# Altium schematic sheet ProtectionLED.SchDoc: ProtectionLED
size Letter; DocumentNumber: 2; SheetNumber: 2; SheetTotal: 4; Conceptor: Philippe T. Simon B. Léonard G. Alexia B-L.; Version: Gamma 1.0
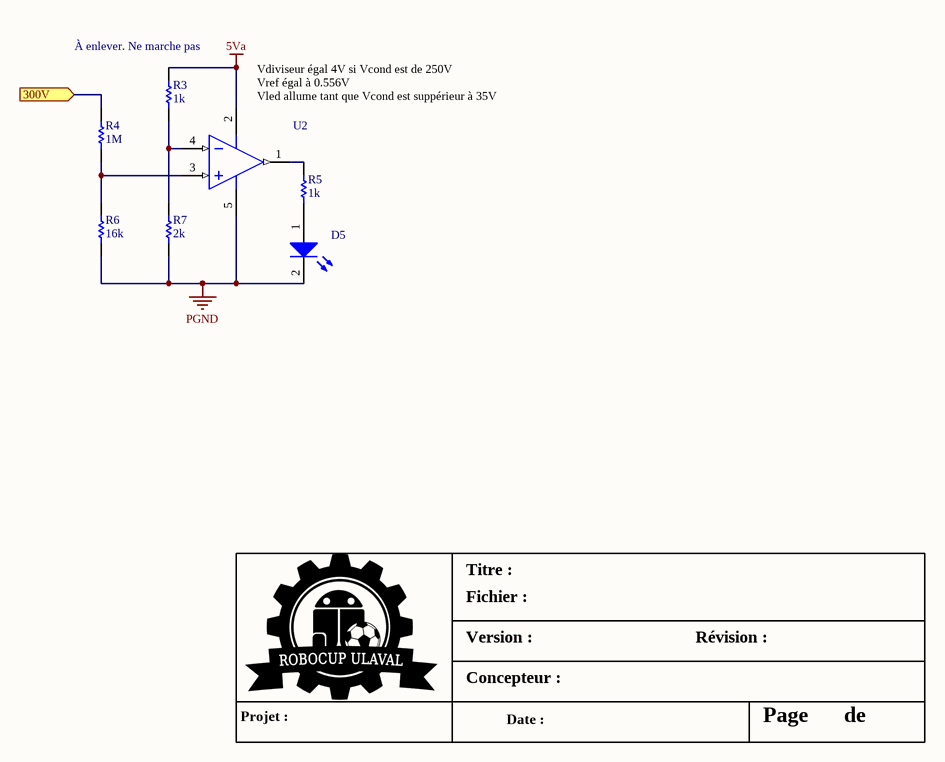
[diagram p0: ProtectionLED.SchDoc]

## Parts
D5  APT3216SRCPRV  [1206]  (value not drawn)
R3  Resistance (Ohms): 1k  [0603]  (hidden comment: RC0603JR-071KL)
R4  Resistance (Ohms): 1M  [0603]  (hidden comment: RC0603FR-071ML)
R5  Resistance (Ohms): 1k  [0603]  (hidden comment: RC0603JR-071KL)
R6  Resistance (Ohms): 16k  [1206]  (hidden comment: ERJ-8GEYJ163V)
R7  Resistance (Ohms): 2k  [0603]  (hidden comment: ESR03EZPJ202)
U2  opamp - MCP6L71RT-E/OTCT-ND  [SOT-23-5]  (value not drawn)

## Ports
300V (in)

## Nets
5Va: R3.2 U2.2(V+)
PGND: D5.2(K) R6.2 R7.1 U2.5(V-)
300V: R4.2 ; port 300V
NetD5_1: D5.1(A) R5.1
NetR3_1: R3.1 R7.2 U2.4(IN-)
NetR4_1: R4.1 R6.1 U2.3(IN+)
NetR5_2: R5.2 U2.1(OUT)

## Notes on the sheet
- (near R3) À enlever. Ne marche pas
- (near U2) Vdiviseur égal 4V si Vcond est de 250V
  Vref égal à 0.556V
  Vled allume tant que Vcond est suppérieur à 35V
- Titre :
- Version :
- Fichier :
- Révision :
- Projet :
- Concepteur :
- Date :
- Page
- de

## Library data of the parts
D5 = APT3216SRCPRV: LED RED CLEAR 1206 SMD; Manufacturer: Kingbright; Lens Color: Colorless; Millicandela Rating: 30mcd; Lens Style/Size: Rectangle with Flat Top, 2.00mm x 1.60mm; Voltage - Forward (Vf) (Typ): 1.85V; Current - Test: 20mA; Viewing Angle: 120°; Wavelength - Dominant: 640nm; Wavelength - Peak: 655nm; Supplier 1: Digi-Key; Manufacturer Part Number: APT3216SRCPRV; RoHS: RoHS Compliant; Category: Optoelectronics; Stock 1: 56279; Pricing 1: 1=0.64, 10=0.462, 25=0.3536, 100=0.2308, 250=0.1692, 500=0.14356, 1000=0.11793 (CAD); Packaging: Cut Tape (CT); Part Status: Active; Color: Red; Lens Transparency: Clear; Mounting Type: Surface Mount; Features: -; Package / Case: 1206 (3216 Metric); Supplier Device Package: Chip LED; Size / Dimension: 3.20mm L x 1.60mm W; Height (Max): 0.75mm; ComponentLink1URL: http://www.kingbrightusa.com/images/catalog/SPEC/APT3216SRCPRV.pdf; ComponentLink1Description: http://www.kingbrightusa.com/images/catalog/SPEC/APT3216SRCPRV.pdf; Supplier Part Number 1: 754-1142-1-ND
R3 R5 = RC0603JR-071KL: RES SMD 1K OHM 5% 1/10W 0603; Manufacturer: Yageo; Power (Watts): 0.1W, 1/10W; Temperature Coefficient: ±100ppm/°C; Supplier 1: Digi-Key; Manufacturer Part Number: RC0603JR-071KL; RoHS: RoHS Compliant; Category: Resistors; Stock 1: 1078221; Pricing 1: 1=0.15, 10=0.017, 25=0.012, 100=0.0067, 250=0.00508, 500=0.00408, 1000=0.003, 2500=0.0026 (CAD); Packaging: Cut Tape (CT); Tolerance: ±5%; Composition: Thick Film; Features: Moisture Resistant; Operating Temperature: -55°C ~ 155°C; Package / Case: 0603 (1608 Metric); Supplier Device Package: 0603; Size / Dimension: 0.063" L x 0.031" W (1.60mm x 0.80mm); Height: 0.022" (0.55mm); Number of Terminations: 2; ComponentLink1URL: http://www.yageo.com/documents/recent/PYu-RC_Group_51_RoHS_L_04.pdf; ComponentLink1Description: http://www.yageo.com/documents/recent/PYu-RC_Group_51_RoHS_L_04.pdf; Supplier Part Number 1: 311-1.0KGRCT-ND
R4 = RC0603FR-071ML: RES SMD 1M OHM 1% 1/10W 0603; Manufacturer: Yageo; Power (Watts): 0.1W, 1/10W; Temperature Coefficient: ±100ppm/°C; Supplier 1: Digi-Key; Manufacturer Part Number: RC0603FR-071ML; RoHS: RoHS Compliant; Category: Resistors; Stock 1: 1571699; Pricing 1: 1=0.15, 10=0.021, 25=0.0152, 100=0.0086, 250=0.0066, 500=0.00526, 1000=0.00389, 2500=0.00337 (CAD); Packaging: Cut Tape (CT); Tolerance: ±1%; Composition: Thick Film; Features: Moisture Resistant; Operating Temperature: -55°C ~ 155°C; Package / Case: 0603 (1608 Metric); Supplier Device Package: 0603; Size / Dimension: 0.063" L x 0.031" W (1.60mm x 0.80mm); Height: 0.022" (0.55mm); Number of Terminations: 2; ComponentLink1URL: http://www.yageo.com/documents/recent/PYu-RC_Group_51_RoHS_L_04.pdf; ComponentLink1Description: http://www.yageo.com/documents/recent/PYu-RC_Group_51_RoHS_L_04.pdf; Supplier Part Number 1: 311-1.00MHRCT-ND
R6 = ERJ-8GEYJ163V: RES SMD 16K OHM 5% 1/4W 1206; Manufacturer: Panasonic Electronic Components; Power (Watts): 0.25W, 1/4W; Temperature Coefficient: ±200ppm/°C; Supplier 1: Digi-Key; Manufacturer Part Number: ERJ-8GEYJ163V; RoHS: RoHS Compliant; Category: Resistors; Stock 1: 39630; Pricing 1: 1=0.15, 50=0.0318, 100=0.0235, 250=0.01788, 500=0.01428, 1000=0.01053 (CAD); Packaging: Cut Tape (CT); Part Status: Active; Tolerance: ±5%; Composition: Thick Film; Features: Automotive AEC-Q200; Operating Temperature: -55°C ~ 155°C; Package / Case: 1206 (3216 Metric); Supplier Device Package: 1206; Size / Dimension: 0.126" L x 0.063" W (3.20mm x 1.60mm); Height - Seated (Max): 0.028" (0.70mm); Number of Terminations: 2; Failure Rate: -; ComponentLink1URL: http://industrial.panasonic.com/www-cgi/jvcr13pz.cgi?E+PZ+3+AOA0001+ERJ8GEYJ163V+7+WW; ComponentLink1Description: http://industrial.panasonic.com/www-cgi/jvcr13pz.cgi?E+PZ+3+AOA0001+ERJ8GEYJ163V+7+WW; Supplier Part Number 1: P16KECT-ND
R7 = ESR03EZPJ202: RES SMD 2K OHM 5% 1/4W 0603; Manufacturer: Rohm Semiconductor; Power (Watts): 0.25W, 1/4W; Temperature Coefficient: ±200ppm/°C; Supplier 1: Digi-Key; Manufacturer Part Number: ESR03EZPJ202; RoHS: RoHS Compliant; Category: Resistors; Stock 1: 4636; Pricing 1: 1=0.15, 10=0.12, 25=0.0824, 100=0.0459, 250=0.03572, 500=0.0284, 1000=0.02015 (CAD); Packaging: Cut Tape (CT); Tolerance: ±5%; Composition: Thick Film; Features: Automotive AEC-Q200, Pulse Withstanding; Operating Temperature: -55°C ~ 155°C; Package / Case: 0603 (1608 Metric); Supplier Device Package: 0603; Size / Dimension: 0.063" L x 0.031" W (1.60mm x 0.80mm); Height: 0.022" (0.55mm); Number of Terminations: 2; ComponentLink1URL: http://rohmfs.rohm.com/en/products/databook/datasheet/passive/resistor/chip_resistor/esr.pdf; ComponentLink1Description: http://rohmfs.rohm.com/en/products/databook/datasheet/passive/resistor/chip_resistor/esr.pdf; Supplier Part Number 1: RHM2.0KDCT-ND
U2 = IC OPAMP GP 2MHZ RRO SOT23-5: FET Operational Amplifier; Supplier 1: Digi-Key; Supplier Part Number 1: MCP6L71RT-E/OTCT-ND